# EAGLE schematic picoboy (EAGLE 9.6.2)

## Sheet 1 of 2
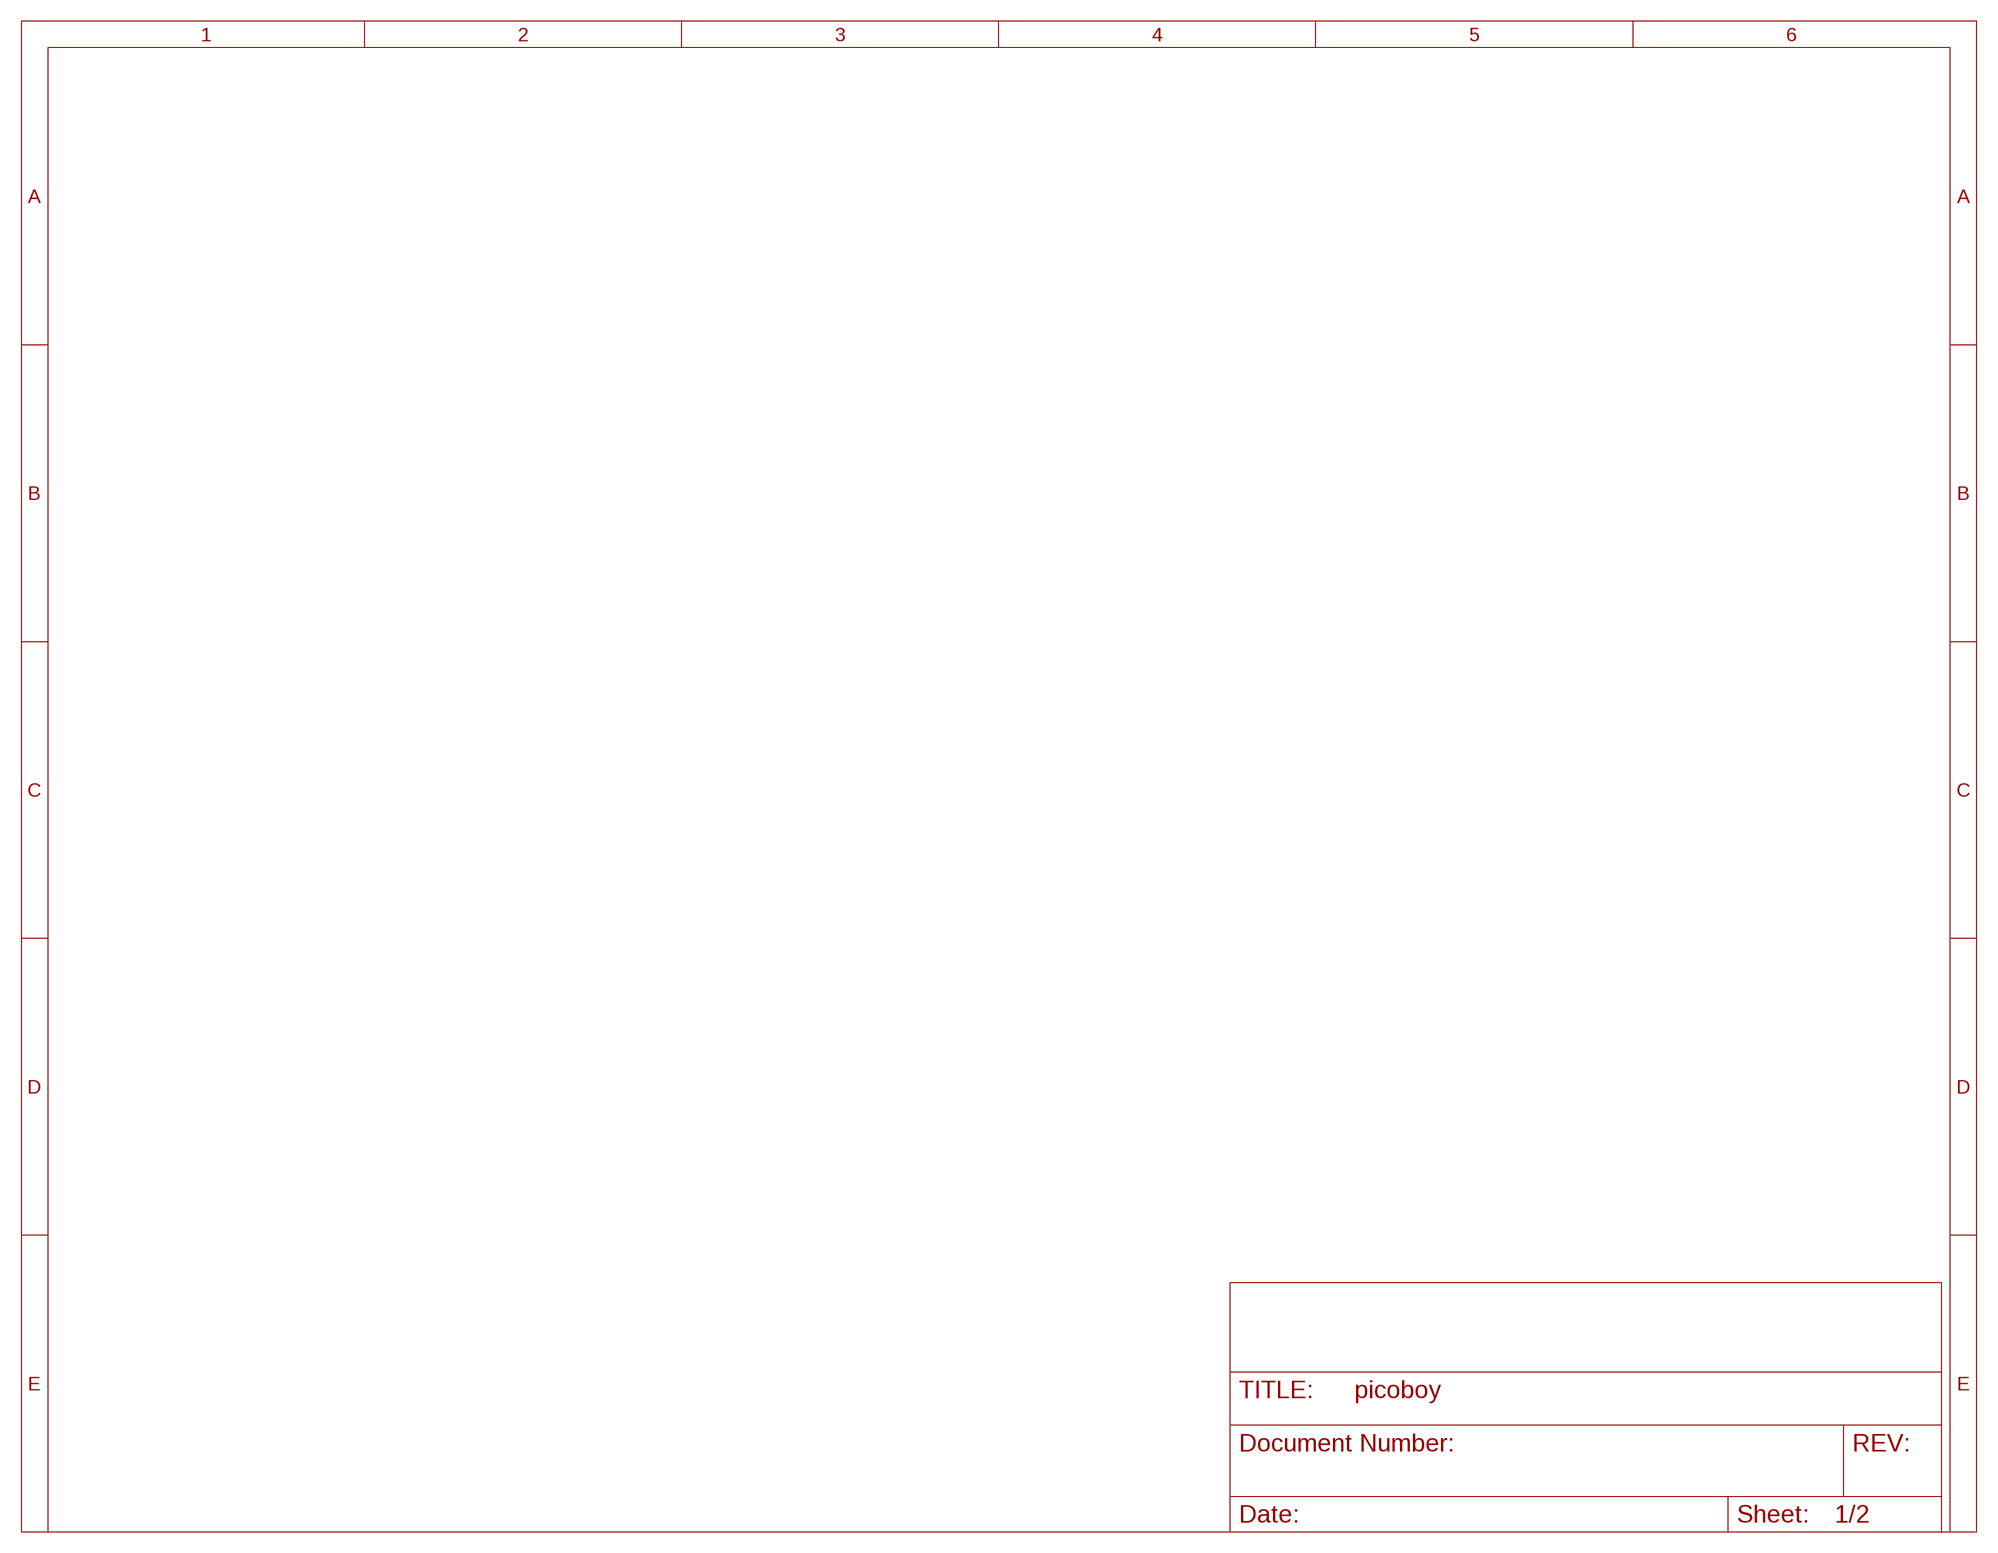
[diagram p0: schematic, sheet 1]

## Sheet 2 of 2
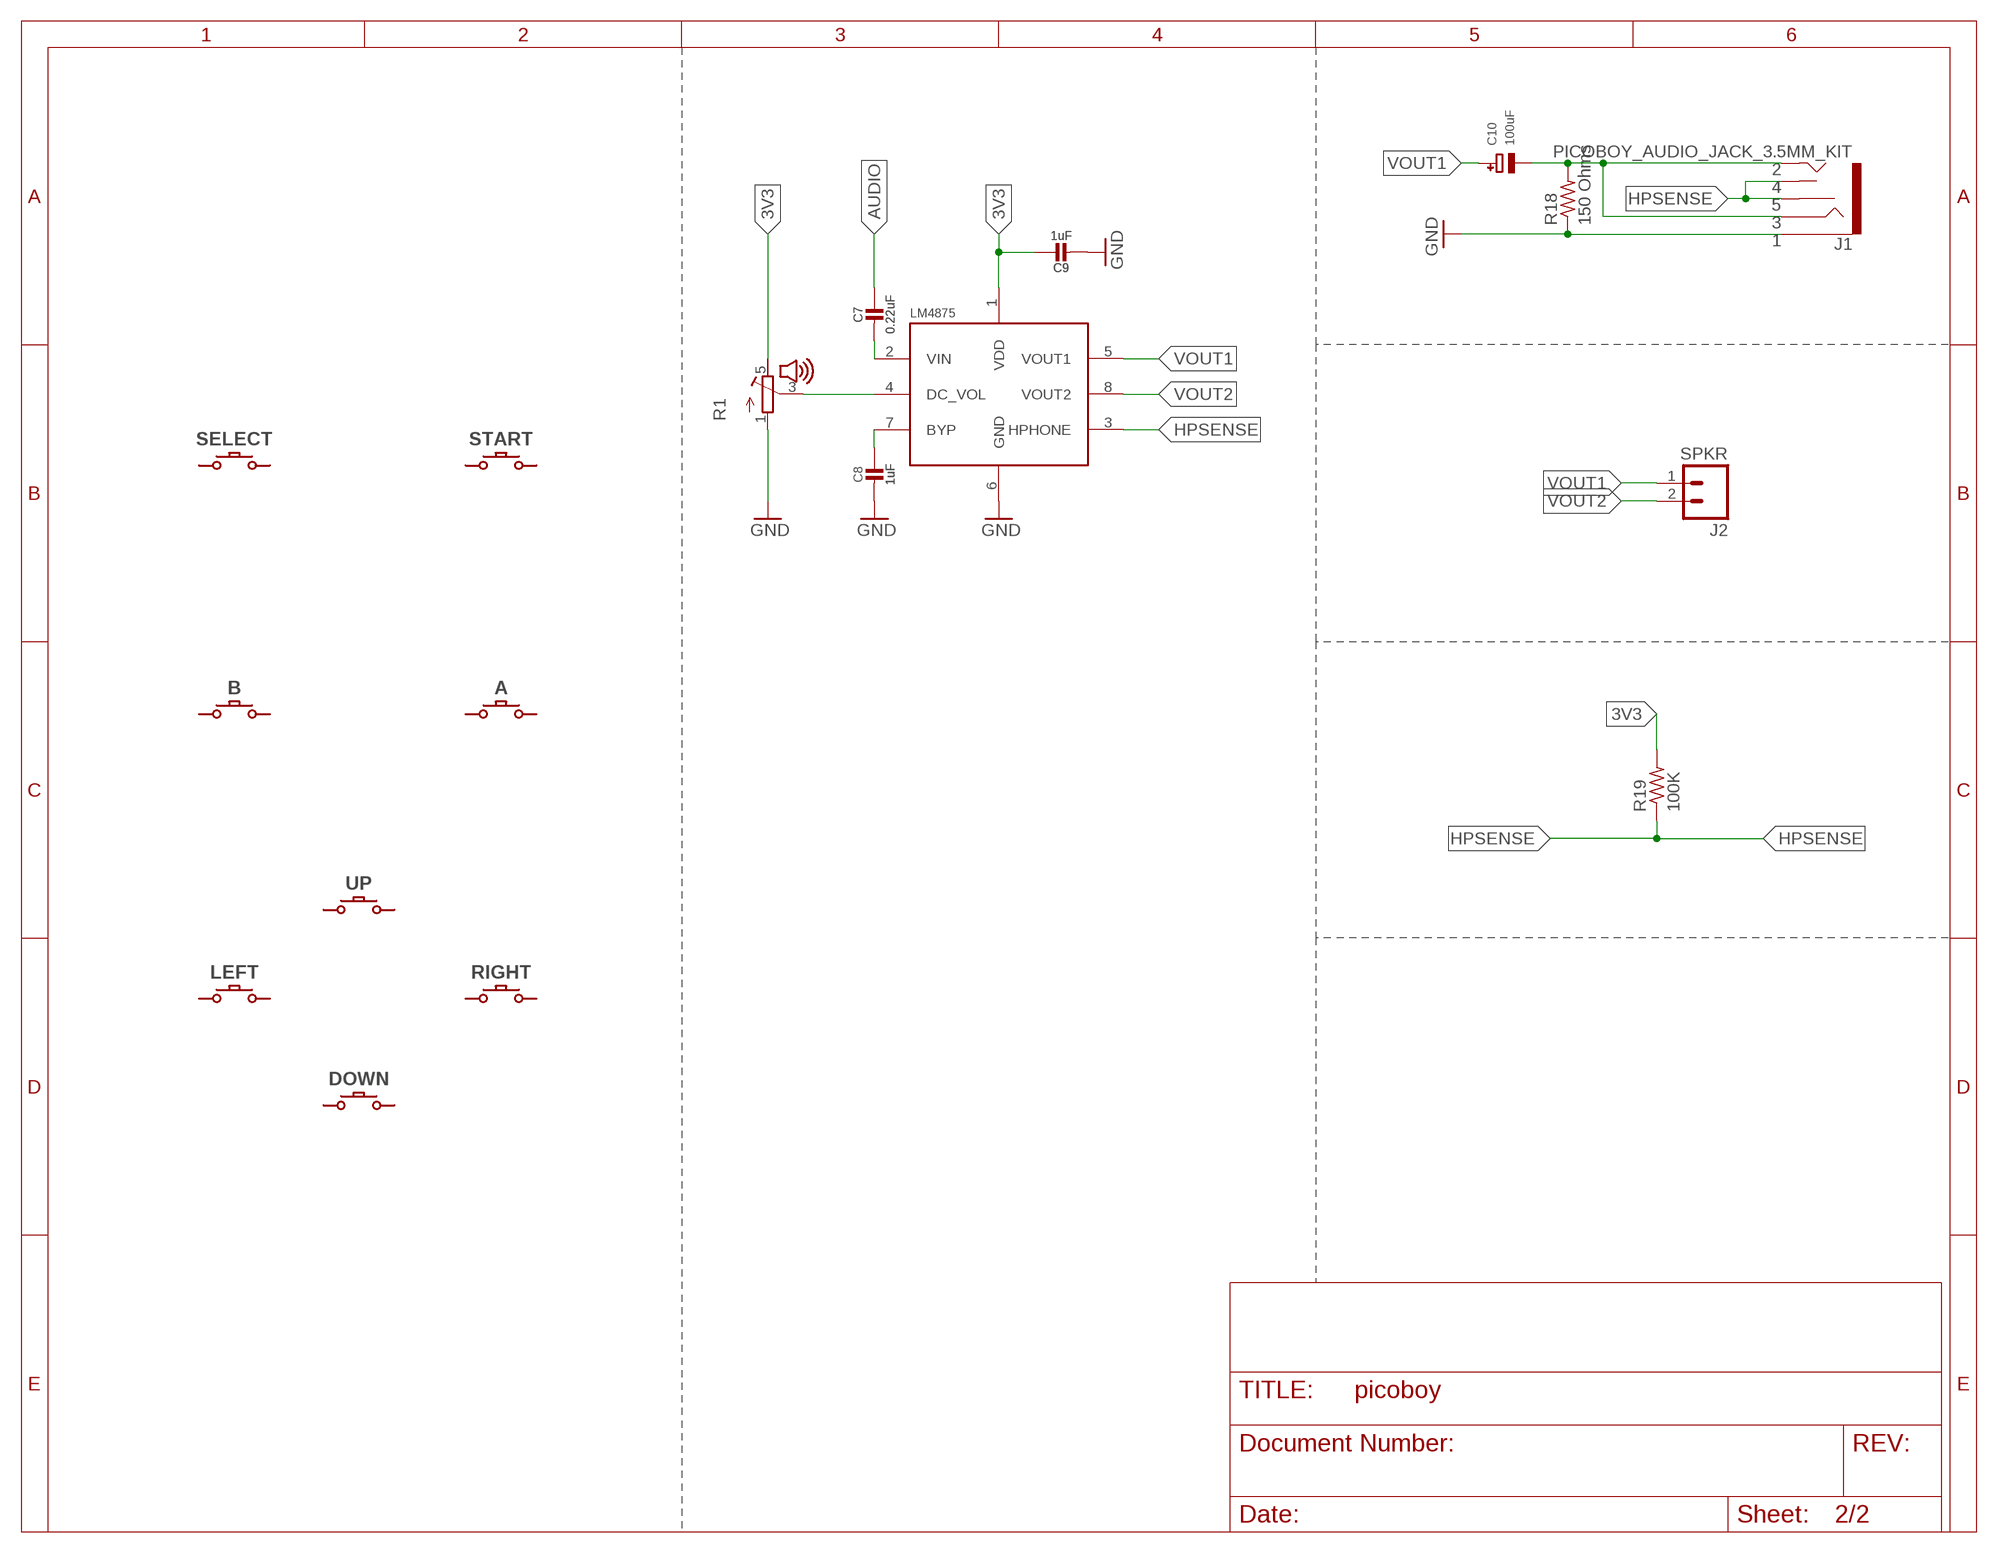
[diagram p1: schematic, sheet 2]

### Parts
A  PICOBOY_CONDUCTIVE_BUTTONCONDUCTIVE_BUTTON_THICK  [PICOBOY_CONDUCTIVE_BUTTON_THICK]
B  PICOBOY_CONDUCTIVE_BUTTONCONDUCTIVE_BUTTON_THICK  [PICOBOY_CONDUCTIVE_BUTTON_THICK]
C7  0.22uF  PICOBOY_CAPACITOR_CERAMIC  [PICOBOY_CAPACITOR_0603-MINI]
C8  1uF  PICOBOY_CAPACITOR_CERAMIC  [PICOBOY_CAPACITOR_0603-MINI]
C9  1uF  PICOBOY_CAPACITOR_CERAMIC  [PICOBOY_CAPACITOR_0603-MINI]
C10  100uF  PICOBOY_CAPACITOR_TANTALUMA/3216_WAVE  [PICOBOY_CAPACITOR_EIA3216-18/A-W]
DOWN  PICOBOY_CONDUCTIVE_BUTTONCONDUCTIVE_BUTTON_DIRECTIONAL_THICK  [PICOBOY_CONDUCTIVE_BUTTON_DIRECTIONAL_THICK]
J1  PICOBOY_AUDIO_JACK_3.5MM_KIT  [PICOBOY_AUDIO-JACK-KIT]
J2  SPKR  M02  [02P]
LEFT  PICOBOY_CONDUCTIVE_BUTTONCONDUCTIVE_BUTTON_DIRECTIONAL_THICK  [PICOBOY_CONDUCTIVE_BUTTON_DIRECTIONAL_THICK]
LM4875  PICOBOY_LM4875  [PICOBOY_LM4875]
R1  PICOBOY_VOLUME_WHEEL  [PICOBOY_VOLUME_WHEEL]
R18  150 Ohms  R-US_R0603  [R0603]
R19  100K  R-US_R0603  [R0603]
RIGHT  PICOBOY_CONDUCTIVE_BUTTONCONDUCTIVE_BUTTON_DIRECTIONAL_THICK  [PICOBOY_CONDUCTIVE_BUTTON_DIRECTIONAL_THICK]
SELECT  PICOBOY_CONDUCTIVE_BUTTON_STARTSELECTCONDUCTIVE_BUTTON_THICK_STARTSELECT  [PICOBOY_CONDUCTIVE_BUTTON_THICK_STARTSELECT]
START  PICOBOY_CONDUCTIVE_BUTTON_STARTSELECTCONDUCTIVE_BUTTON_THICK_STARTSELECT  [PICOBOY_CONDUCTIVE_BUTTON_THICK_STARTSELECT]
UP  PICOBOY_CONDUCTIVE_BUTTONCONDUCTIVE_BUTTON_DIRECTIONAL_THICK  [PICOBOY_CONDUCTIVE_BUTTON_DIRECTIONAL_THICK]

### Nets
3V3: C9.1 LM4875.1(VDD) R1.5(E) R19.2
AUDIO: C7.1
BYP: C8.1 LM4875.7(BYP)
DC_VOL: LM4875.4(DC_VOL) R1.3(S)
GND: C8.2 C9.2 J1.SLEEVE LM4875.6(GND) R1.1(A) R18.1
HPSENSE: J1.RSH J1.TSH LM4875.3(HPHONE) R19.1
N$7: C10.- J1.RING J1.TIP R18.2
VIN: C7.2 LM4875.2(VIN)
VOUT1: C10.+ J2.1 LM4875.5(VOUT1)
VOUT2: J2.2 LM4875.8(VOUT2)
Unconnected: A.P$ACTIVE A.P$GND B.P$ACTIVE B.P$GND DOWN.P$ACTIVE DOWN.P$GND LEFT.P$ACTIVE LEFT.P$GND RIGHT.P$ACTIVE RIGHT.P$GND SELECT.P$ACTIVE SELECT.P$ACTIVE1(P$ACTIVE) SELECT.P$ACTIVE2(P$ACTIVE) SELECT.P$ACTIVE3(P$ACTIVE) SELECT.P$ACTIVE4(P$ACTIVE) SELECT.P$ACTIVE5(P$ACTIVE) SELECT.P$ACTIVE6(P$ACTIVE) SELECT.P$GND SELECT.P$GND1(P$GND) SELECT.P$GND2(P$GND) SELECT.P$GND3(P$GND) START.P$ACTIVE START.P$ACTIVE1(P$ACTIVE) START.P$ACTIVE2(P$ACTIVE) START.P$ACTIVE3(P$ACTIVE) START.P$ACTIVE4(P$ACTIVE) START.P$ACTIVE5(P$ACTIVE) START.P$ACTIVE6(P$ACTIVE) START.P$GND START.P$GND1(P$GND) START.P$GND2(P$GND) START.P$GND3(P$GND) UP.P$ACTIVE UP.P$GND

## Library data of the parts
A B DOWN LEFT RIGHT UP = picoboy:PICOBOY_CONDUCTIVE_BUTTON: Play Button
C7-C9 = picoboy:PICOBOY_CAPACITOR_CERAMIC: Ceramic Capacitors For new designs, use the packages preceded by an '_' character since they are more reliable: The following footprints should be used on most boards: _0402 - Standard footprint for regular board layouts _0603 - Standard footprint for regular board layouts _0805 - Standard footprint for regular board layouts _1206 - Standard footprint for regular board layouts For extremely tight-pitch boards where space is at a premium, the following 'micro-pitch' footprints can be used (smaller pads, no silkscreen outline, etc.): _0402MP - Micro-pitch footprint for very dense/compact boards _0603MP - Micro-pitch footprint for very dense/compact boards _0805MP - Micro-pitch footprint for very dense/compact boards _1206MP - Micro-pitch footprint for very dense/compact boards
C10 = picoboy:PICOBOY_CAPACITOR_TANTALUM: Tantalum Capacitors Wave footprints have larger pads and are meant to be used for hand soldering. Reflow footprints are optimised for solder paste and a reflow oven. EIA3216-18/A-[R/W] - Size A / 3216-18 / 1206 footprint 4.7µF 25V 10% Tantalum Capacitor 10µF 16V 10% Tantalum Capacitor [Digikey: 495-2236-2-ND] EIA3528-21/B-[R/W] - Size B / 3528-21 47µF 10V 10% Tantalum Capactior [Digikey: 495-2216-1-ND] EIA6032-28/C-[R/W] - Size C / 6032-28 10µF 35V 20% Tantalum Capacitor [Digikey: 495-2285-1-ND] 100µF 16V 10% Tantalum Capactior [Digikey: 399-5214-1-ND]
J1 = picoboy:PICOBOY_AUDIO_JACK_3.5MM: Audio Jack 3.5mm variants of PTH and SMT stereo audio jack with bypass switches. SparkFun Products: SparkFun SparkPunk Sound Kit <[https://www.sparkfun.com/products/11177]> - PTH MP3 Trigger <https://www.sparkfun.com/products/13720> -3.5mm SMD SparkFun PicoBoard <https://www.sparkfun.com/products/11888>- 2.5mm SMD; PROD_ID: CONN-10353; SF_ID: PRT-08032
J2 = con-amp-quick:M02: AMP QUICK CONNECTOR; OC_FARNELL: unknown; OC_NEWARK: unknown
LM4875 = picoboy:PICOBOY_LM4875: LM4875
R1 = picoboy:PICOBOY_VOLUME_WHEEL
R18 R19 = rcl:R-US_: RESISTOR, American symbol; SPICEPREFIX: R
SELECT START = picoboy:PICOBOY_CONDUCTIVE_BUTTON_STARTSELECT: Start Select Button